# EAGLE schematic stereo-encoder-nano (EAGLE 6.3)
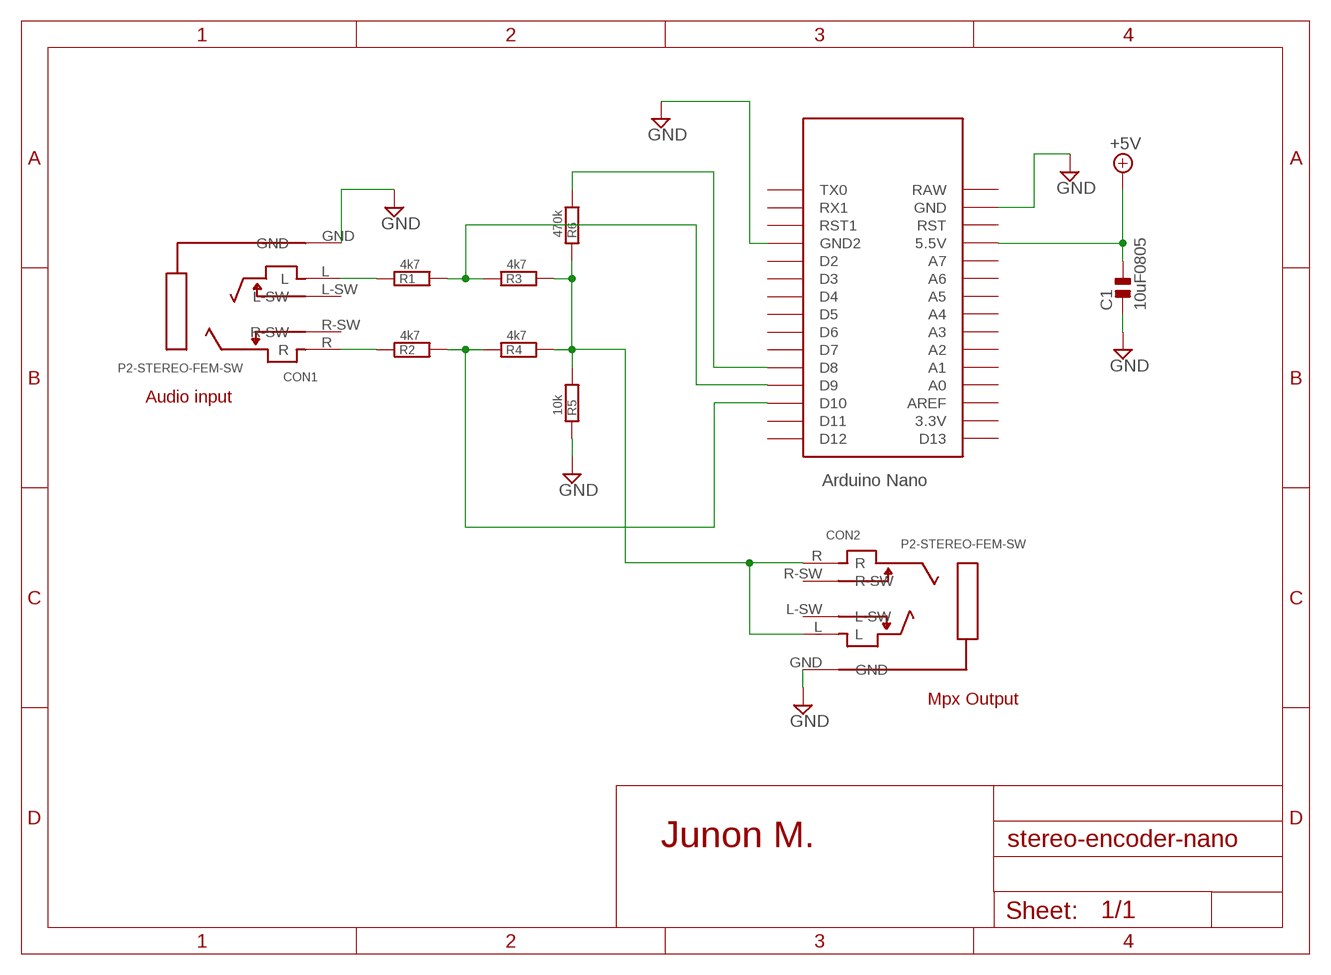
[diagram p0: schematic, sheet 1]

## Parts
C1  10uF0805  C-SMD-0805  [C0805]
CON1  P2-STEREO-FEM-SW  [P2-STEREO-FEM-SW]
CON2  P2-STEREO-FEM-SW  [P2-STEREO-FEM-SW]
R1  4k7  1/4W  [0207/10]
R2  4k7  1/4W  [0207/10]
R3  4k7  1/4W  [0207/10]
R4  4k7  1/4W  [0207/10]
R5  10k  1/4W  [0207/10]
R6  470k  1/4W  [0207/10]
U$1  NANO  [NANO]

## Nets
+5V: C1.2 U$1.5V(5.5V)
GND: C1.1 CON1.GND CON2.GND R5.1 U$1.GND U$1.GND1(GND2)
N$1: R2.2 R4.1 U$1.D10
N$3: CON2.L CON2.R R3.2 R4.2 R5.2 R6.1
N$5: R6.2 U$1.D8
N$8: CON1.L R1.1
N$9: CON1.R R2.1
N$10: R1.2 R3.1 U$1.D9
Unconnected: CON1.L-SW CON1.R-SW CON2.L-SW CON2.R-SW U$1.3.3V U$1.A0 U$1.A1 U$1.A2 U$1.A3 U$1.A4 U$1.A5 U$1.A6 U$1.A7 U$1.AREF U$1.D2 U$1.D3 U$1.D4 U$1.D5 U$1.D6 U$1.D7 U$1.D11 U$1.D12 U$1.D13 U$1.ICSP1 U$1.ICSP2 U$1.ICSP3 U$1.ICSP4 U$1.ICSP5 U$1.ICSP6 U$1.RAW U$1.RST U$1.RST1 U$1.RX1 U$1.TX0

## Notes on the sheet
- Audio input
- Mpx Output
- Junon M.

## Library data of the parts
C1 = capacitors-ceramic:C-SMD-0805: Ceramic capacitor smd 805
CON1 CON2 = connectors:P2-STEREO-FEM-SW
R1-R6 = resistor:1/4W: Resistor de 1/4 de Watt
U$1 = Arduino-clone:NANO: Arduino Nano